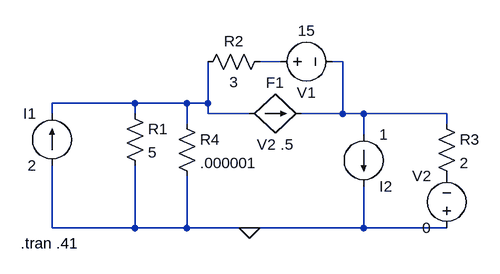
[diagram p0: schematic test2circuit.asc]
test2circuit.asc, the LTspice schematic file:
Version 4.1
SHEET 1 880 680
WIRE 192 32 160 32
WIRE 288 32 272 32
WIRE -32 96 -160 96
WIRE 48 96 -32 96
WIRE 80 96 80 32
WIRE 80 96 48 96
WIRE -160 112 -160 96
WIRE -32 112 -32 96
WIRE 80 112 80 96
WIRE 144 112 80 112
WIRE 288 112 288 32
WIRE 288 112 224 112
WIRE 320 112 288 112
WIRE 448 112 320 112
WIRE 48 128 48 96
WIRE 448 128 448 112
WIRE 320 144 320 112
WIRE -160 288 -160 192
WIRE -32 288 -32 192
WIRE -32 288 -160 288
WIRE 48 288 48 208
WIRE 48 288 -32 288
WIRE 144 288 48 288
WIRE 320 288 320 224
WIRE 320 288 144 288
WIRE 448 288 320 288
FLAG 144 288 0
SYMBOL current -160 192 R180
WINDOW 0 24 80 Left 2
WINDOW 3 24 0 Left 2
WINDOW 123 0 0 Left 0
WINDOW 39 0 0 Left 0
SYMATTR InstName I1
SYMATTR Value 2
SYMBOL res -48 96 R0
SYMATTR InstName R1
SYMATTR Value 5
SYMBOL res 176 16 R90
WINDOW 0 0 56 VBottom 2
WINDOW 3 32 56 VTop 2
SYMATTR InstName R2
SYMATTR Value 3
SYMBOL voltage 176 32 R270
WINDOW 0 -32 56 VBottom 2
WINDOW 3 32 56 VTop 2
WINDOW 123 0 0 Left 0
WINDOW 39 0 0 Left 0
SYMATTR InstName V1
SYMATTR Value 15
SYMBOL res 432 112 R0
SYMATTR InstName R3
SYMATTR Value 2
SYMBOL current 320 144 R0
WINDOW 0 24 80 Left 2
WINDOW 3 24 0 Left 2
WINDOW 123 0 0 Left 0
WINDOW 39 0 0 Left 0
SYMATTR InstName I2
SYMATTR Value 1
SYMBOL f 144 112 R270
WINDOW 0 32 40 VTop 2
WINDOW 3 -32 40 VBottom 2
SYMATTR InstName F1
SYMATTR Value V2 .5
SYMBOL voltage 448 304 R180
WINDOW 0 24 96 Left 2
WINDOW 3 24 16 Left 2
WINDOW 123 0 0 Left 0
WINDOW 39 0 0 Left 0
SYMATTR InstName V2
SYMATTR Value 0
SYMBOL res 32 112 R0
SYMATTR InstName R4
SYMATTR Value .000001
TEXT -208 312 Left 2 !.tran .41

The netlist it stands for:
* test2circuit.asc
I1 0 N003 2
R1 N003 0 5
R2 N001 N003 3
V1 N001 N002 15
R3 N002 P001 2
I2 N002 0 1
F1 N003 N002 V2 .5
V2 0 P001 0
R4 N003 0 .000001
.tran .41
.backanno
.end